# Altium schematic sheet 转接板.SchDoc
size A4
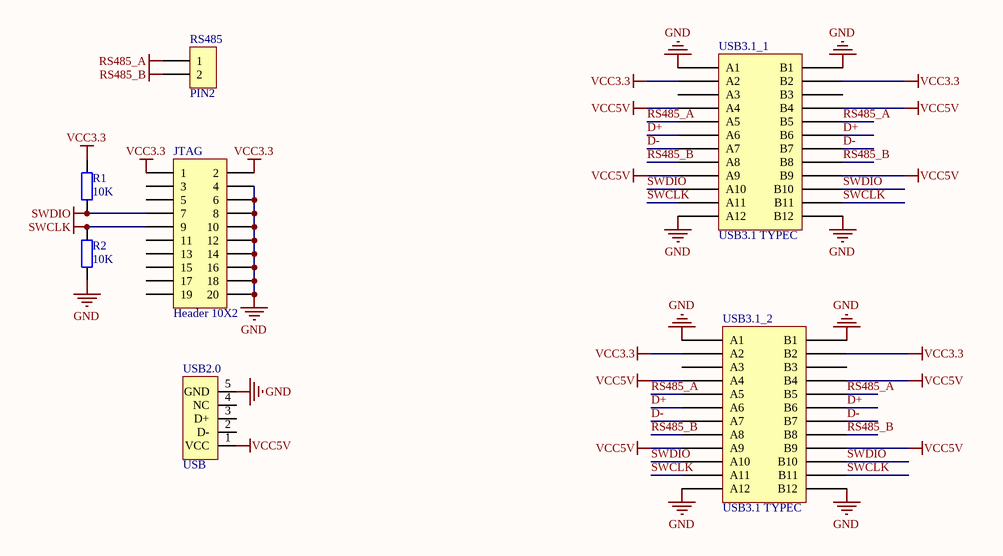
[diagram p0: 转接板.SchDoc]

## Parts
JTAG  Header 10X2  [JTAG_20]
R1  value 10K  [0603]  (hidden comment: Res2)
R2  value 10K  [0603]  (hidden comment: Res2)
RS485  PIN2  [HEAD2L-0.8]
USB2.0  USB  [USB/SM0.8-6H5]
USB3.1_1  USB3.1 TYPEC  [MicroUSB TypeC 3.1 - duplicate]
USB3.1_2  USB3.1 TYPEC  [MicroUSB TypeC 3.1 - duplicate]

## Nets
GND: JTAG.4 JTAG.6 JTAG.8 JTAG.10 JTAG.12 JTAG.14 JTAG.16 JTAG.18 JTAG.20 R2.2 USB2.0.5(GND) USB3.1_1.1(A1) USB3.1_1.12(A12) USB3.1_1.13(B12) USB3.1_1.24(B1) USB3.1_2.1(A1) USB3.1_2.12(A12) USB3.1_2.13(B12) USB3.1_2.24(B1)
RS485_A: RS485.1 USB3.1_1.5(A5) USB3.1_1.20(B5) USB3.1_2.5(A5) USB3.1_2.20(B5)
RS485_B: RS485.2 USB3.1_1.8(A8) USB3.1_1.17(B8) USB3.1_2.8(A8) USB3.1_2.17(B8)
SWCLK: JTAG.9 R2.1 USB3.1_1.11(A11) USB3.1_1.14(B11) USB3.1_2.11(A11) USB3.1_2.14(B11)
SWDIO: JTAG.7 R1.2 USB3.1_1.10(A10) USB3.1_1.15(B10) USB3.1_2.10(A10) USB3.1_2.15(B10)
VCC3.3: JTAG.1 JTAG.2 R1.1 USB3.1_1.2(A2) USB3.1_1.23(B2) USB3.1_2.2(A2) USB3.1_2.23(B2)
VCC5V: USB2.0.1(VCC) USB3.1_1.4(A4) USB3.1_1.9(A9) USB3.1_1.16(B9) USB3.1_1.21(B4) USB3.1_2.4(A4) USB3.1_2.9(A9) USB3.1_2.16(B9) USB3.1_2.21(B4)
D+: USB3.1_1.6(A6) USB3.1_1.19(B6) USB3.1_2.6(A6) USB3.1_2.19(B6)
D-: USB3.1_1.7(A7) USB3.1_1.18(B7) USB3.1_2.7(A7) USB3.1_2.18(B7)

Not connected (* = marked no-connect by the designer): JTAG 3 5 11 13 15 17 19; USB2.0 2(D-) 3(D+) 4(NC); USB3.1_1 3(A3) 22(B3); USB3.1_2 3(A3) 22(B3)

## Library data of the parts
JTAG = Header 10X2: Header, 10-Pin, Dual row; LatestRevisionDate: 17-Jul-2002; LatestRevisionNote: Re-released for DXP Platform.; Publisher: Altium Limited
R1 R2 = Res2: Resistor; Published: 8-Jun-2000; LatestRevisionDate: 17-Jul-2002; LatestRevisionNote: Re-released for DXP Platform.; PackageReference: AXIAL-0.4; Publisher: Altium Limited
USB2.0 = USB5